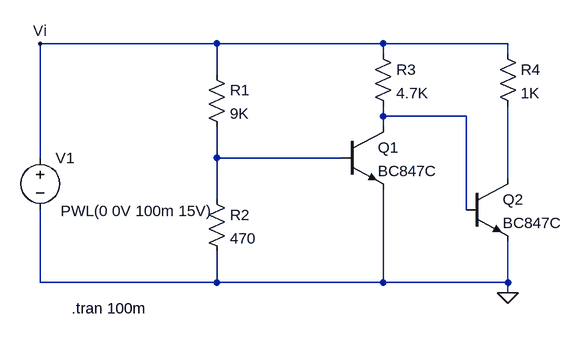
[diagram p0: schematic npnovervoltage.asc]
npnovervoltage.asc, the LTspice schematic file:
Version 4
SHEET 1 880 680
WIRE 160 -80 -112 -80
WIRE 416 -80 160 -80
WIRE 608 -80 416 -80
WIRE 416 -64 416 -80
WIRE 608 -64 608 -80
WIRE 160 -32 160 -80
WIRE 416 32 416 16
WIRE 544 32 416 32
WIRE 416 48 416 32
WIRE -112 96 -112 -80
WIRE 160 96 160 48
WIRE 352 96 160 96
WIRE 608 128 608 16
WIRE 160 160 160 96
WIRE 544 176 544 32
WIRE -112 288 -112 176
WIRE 160 288 160 240
WIRE 160 288 -112 288
WIRE 416 288 416 144
WIRE 416 288 160 288
WIRE 608 288 608 224
WIRE 608 288 416 288
WIRE 608 304 608 288
FLAG 608 304 0
FLAG -112 -80 Vi
SYMBOL voltage -112 80 R0
WINDOW 3 149 82 Top 2
WINDOW 123 0 0 Left 0
WINDOW 39 0 0 Left 0
SYMATTR Value PWL(0 0V 100m 15V)
SYMATTR InstName V1
SYMBOL res 144 -48 R0
SYMATTR InstName R1
SYMATTR Value 9K
SYMBOL res 144 144 R0
SYMATTR InstName R2
SYMATTR Value 470
SYMBOL npn 352 48 R0
SYMATTR InstName Q1
SYMATTR Value BC847C
SYMBOL res 400 -80 R0
SYMATTR InstName R3
SYMATTR Value 4.7K
SYMBOL res 592 -80 R0
SYMATTR InstName R4
SYMATTR Value 1K
SYMBOL npn 544 128 R0
SYMATTR InstName Q2
SYMATTR Value BC847C
TEXT -64 328 Left 2 !.tran 100m

The netlist it stands for:
* npnovervoltage.asc
V1 Vi 0 PWL(0 0V 100m 15V)
R1 Vi N002 9K
R2 N002 0 470
Q1 N001 N002 0 0 BC847C
R3 Vi N001 4.7K
R4 Vi N003 1K
Q2 N003 N001 0 0 BC847C
.model NPN NPN
.model PNP PNP
.lib standard.bjt
.tran 100m
.backanno
.end